# EAGLE design shield_RN2483A (EAGLE 7.5.0)
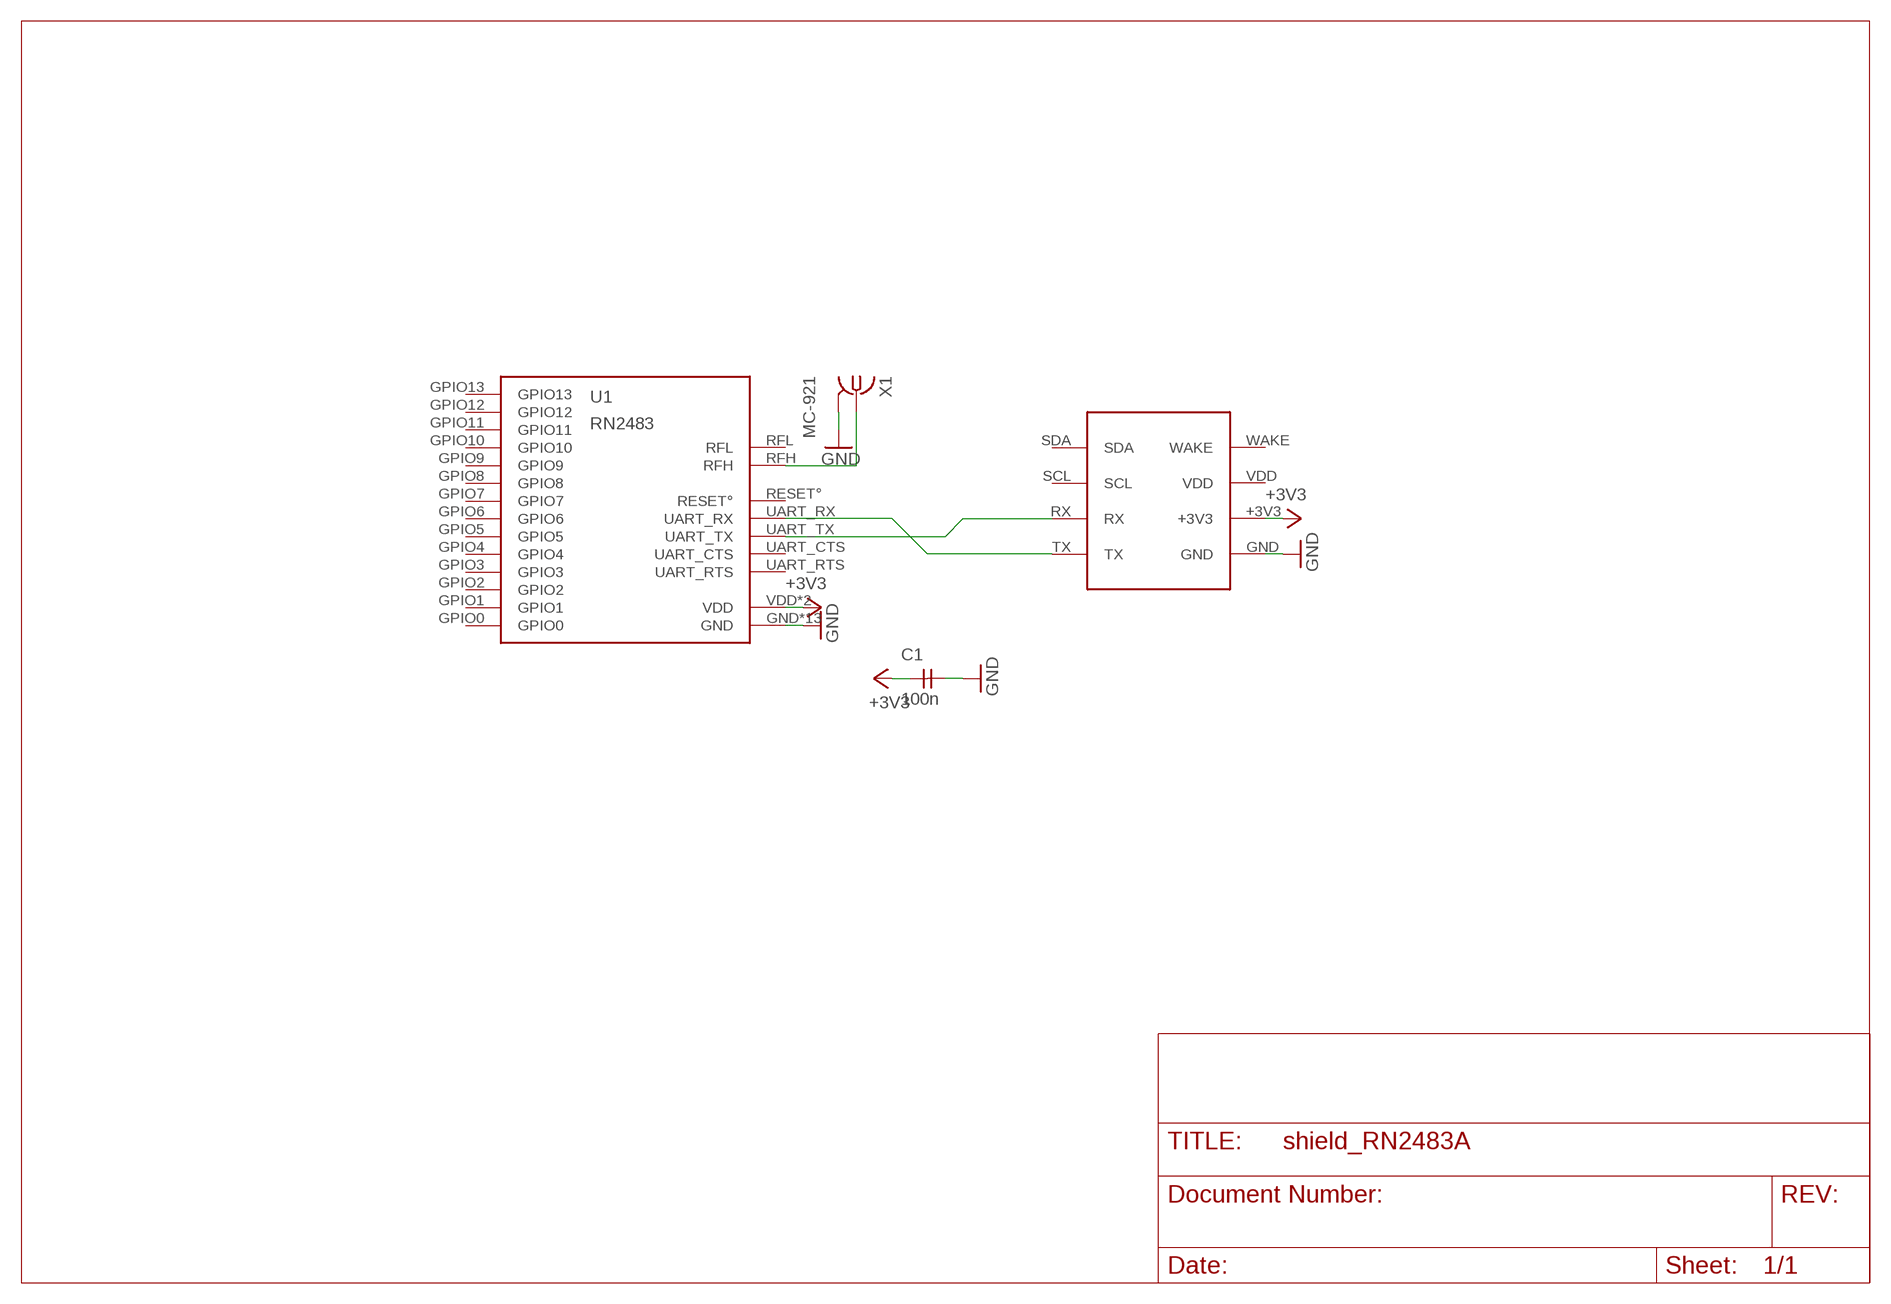
[diagram p0: schematic, sheet 1]

## Parts
C1  100n  CSMD_1206  [SMD_RC_1206]
U1  RN2483  [RN2483]
U$1  SHIELD  [SHIELD]
X1  MC-921  [MC-921]

## Nets
+3V3: C1.P$1 U1.VDD U1.VDD2(VDD) U$1.+3V3
GND: C1.P$2 U1.GND U1.GND1(GND) U1.GND2(GND) U1.GND3(GND) U1.GND4(GND) U1.GND5(GND) U1.GND6(GND) U1.GND7(GND) U1.GND8(GND) U1.GND9(GND) U1.GND10(GND) U1.GND11(GND) U1.GND12(GND) U$1.GND X1.2@1(GND) X1.2@2(GND)
N$1: U1.UART_TX U$1.RX
N$2: U1.UART_RX U$1.TX
N$6: U1.RFH X1.1
Unconnected: U1.GPIO0 U1.GPIO1 U1.GPIO2 U1.GPIO3 U1.GPIO4 U1.GPIO5 U1.GPIO6 U1.GPIO7 U1.GPIO8 U1.GPIO9 U1.GPIO10 U1.GPIO11 U1.GPIO12 U1.GPIO13 U1.RESET° U1.RFL U1.UART_CTS U1.UART_RTS U$1.SCL U$1.SDA U$1.WAKE

## Power pins joined to a net without a drawn wire
VDD: U$1.VDD

## Library data of the parts
C1 = balance:C
U1 = tobias:RN2483: RN2483 Microchip Low-Power Lora Transceiver Module NOT TESTED There are testpads on the bottom of the device. The mask is supposed to cover that, but I have not tested it in practice yet. Info: http://www.microchip.com/wwwproducts/Devices.aspx?product=RN2483 Datasheet: http://ww1.microchip.com/downloads/en/DeviceDoc/50002346B.pdf Adapted from: https://github.com/Octanis1/Octanis1-Electronics/blob/ae493cac28c100e20856abe563dfe8824e9cc4bd/lib/Octanis1.lbr
U$1 = balance:SHIELD
X1 = con-coax:MC-921: COAX. MICROWAVE CONNECTOR O/D diam 2.1 Source: www.tycoelectronics.com .. Electronics .. ENG_CD_1775146_A2.pdf; OC_FARNELL: unknown; OC_NEWARK: unknown

## Net classes
0 default: clearance 0.205 mm

## Board
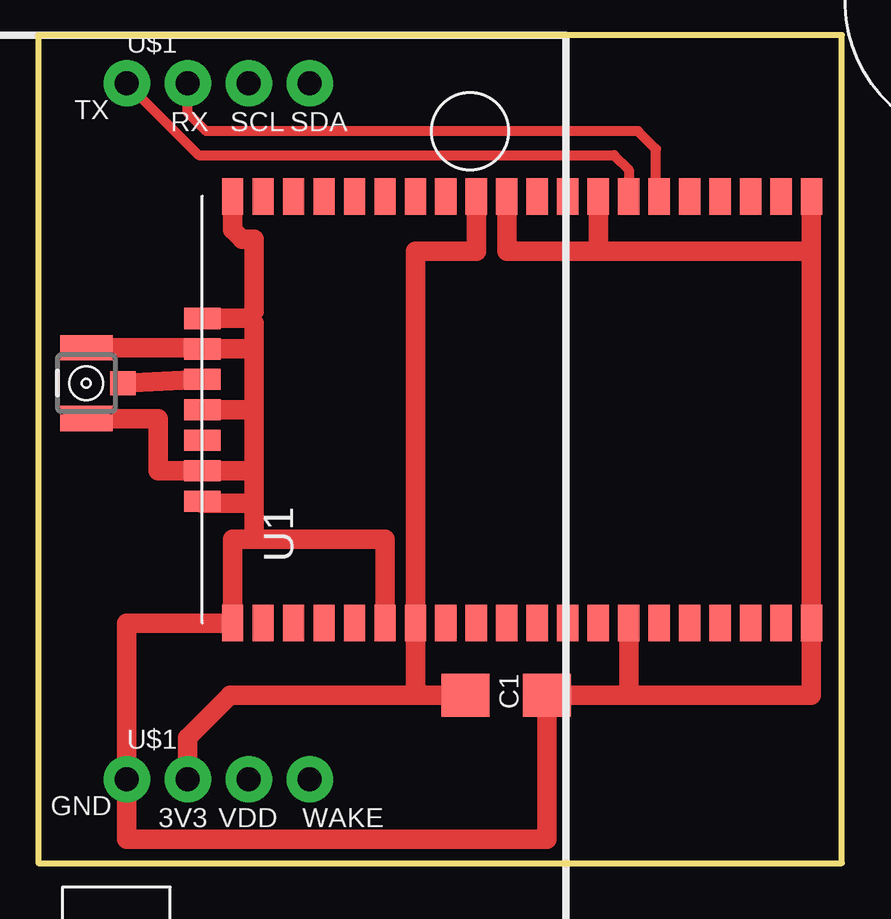
[diagram p1: board, top side]

No outline drawn. Coordinates in mm, seen from the top.
Copper layers (1*16): Top 0.035mm / dielectric 1.5mm / Bottom 0.035mm
Design rules "SeeedStudio_2layer_DRU_no_angle_20140221": minimum track width 6mil, minimum drill 12mil, track to track 6mil, track to pad 6mil, pad to pad 6mil, via to via 6mil, smd to smd 0mil, copper to edge 10mil, drill to drill 10mil, minimum pad ring 10mil, minimum via ring 6mil, stop-mask expansion 2mil, vias tented up to drill 100mil, thermal gap 10mil
Milling: 4 lines

### Footprints (pad centres in the part's own frame; a part is rotated, then mirrored left to right if it is on the bottom)
SMD_RC_1206 = smd 2 x 1.8: P$1 -1.7,0; P$2 1.7,0
RN2483 = smd 1.524 x 0.889: GND 17.78,1.27; GND1 17.78,10.16; GND2 17.78,13.97; GND3 17.78,25.4; GND9 0,25.4; GND10 0,19.05; GND11 0,8.89; GND12 0,1.27; GPIO0 0,16.51; GPIO1 0,15.24; GPIO2 0,13.97; GPIO3 0,12.7; GPIO4 0,11.43; GPIO5 0,10.16; GPIO6 0,6.35; GPIO7 0,5.08; GPIO8 0,3.81; GPIO9 0,2.54; GPIO10 17.78,17.78; GPIO11 17.78,16.51; GPIO12 17.78,12.7; GPIO13 17.78,11.43; P$1 0,21.59; P$2 0,22.86; P$3 0,24.13; P$4 17.78,24.13; P$5 17.78,22.86; P$6 17.78,21.59; P$7 17.78,20.32; P$8 17.78,19.05; P$9 17.78,6.35; P$10 17.78,5.08; P$11 0,7.62; RESET° 0,20.32; UART_CTS 17.78,3.81; UART_RTS 17.78,2.54; UART_RX 17.78,8.89; UART_TX 17.78,7.62; VDD 17.78,15.24; VDD2 0,17.78 | smd 0.889 x 1.524: GND4 12.7,26.67; GND5 11.43,26.67; GND6 8.89,26.67; GND7 6.35,26.67; GND8 5.08,26.67; RFH 10.16,26.67; RFL 7.62,26.67
SHIELD = drill 1 pad 1.93: +3V3 36.73,23; GND 34.19,23; RX 36.73,52; SCL 39.27,52; SDA 41.81,52; TX 34.19,52; VDD 39.27,23; WAKE 41.81,23
MC-921 = smd 1 x 1.05: 1 0,1.528 | smd 1.05 x 2.2: 2@1 -1.475,0; 2@2 1.475,0

### Placement (x,y rotation side)
C1  19.5,7 0 top
U1  33.5,10 90 top
U$1  -30.5,-19.5 0 top
X1  2,20 270 top

### Tracks (layer width: path | path; a pad name or v marks a point on that pad's centre or on a via)
+3V3
  Top 0.813: U$1.+3V3 6.23,5.23 8,7 16,7 | 16,7 C1.P$1 | 16,7 15.72,7.28 U1.VDD2 15.72,25.5 18.26,25.5 U1.VDD
GND
  Top 0.813: U1.GND3 8.1,26.4 8.5,26 9,26 9,23 8.75,22.75 | U1.GND4 8.7,22.7 8.75,22.75 | 8.93,21.43 U1.GND5 6.83,21.48 X1.2@1 | 8.93,21.43 9,21.5 9,22.5 8.75,22.75 | 9,13.5 8.1,13.5 U1.GND9 3.69,10 U$1.GND 3.69,1 21.2,1 C1.P$2 24.61,7 | 9,13.5 9,15 | 9,15 9,16.35 | 9,16.35 9,18.89 | 9,18.89 9,21.43 8.93,21.43 | U1.GND8 6.83,15 9,15 | 9,16.35 U1.GND7 5,16.35 5,18.52 X1.2@2 | U1.GND6 9,18.89 | U1.GND11 24.61,7 | 24.61,7 32.23,7 U1.GND12 32.23,25.5 | U1.GND 32.23,25.5 | U1.GND1 23.34,25.5 | 23.34,25.5 32.23,25.5 | U1.GND2 19.53,25.5 23.34,25.5 | U1.GND10 14.45,13.5 9,13.5
N$1
  Top 0.406: U1.UART_TX 25.75,27.91 25.75,29.75 25,30.5 7,30.5 6.23,31.27 U$1.RX
N$2
  Top 0.406: U$1.TX 6.69,29.5 24,29.5 24.61,28.89 U1.UART_RX
N$6
  Top 0.813: X1.1 U1.RFH